# EAGLE design LCD-Backpack-PIC-HD44780-I2C-v1a (EAGLE 5.11)
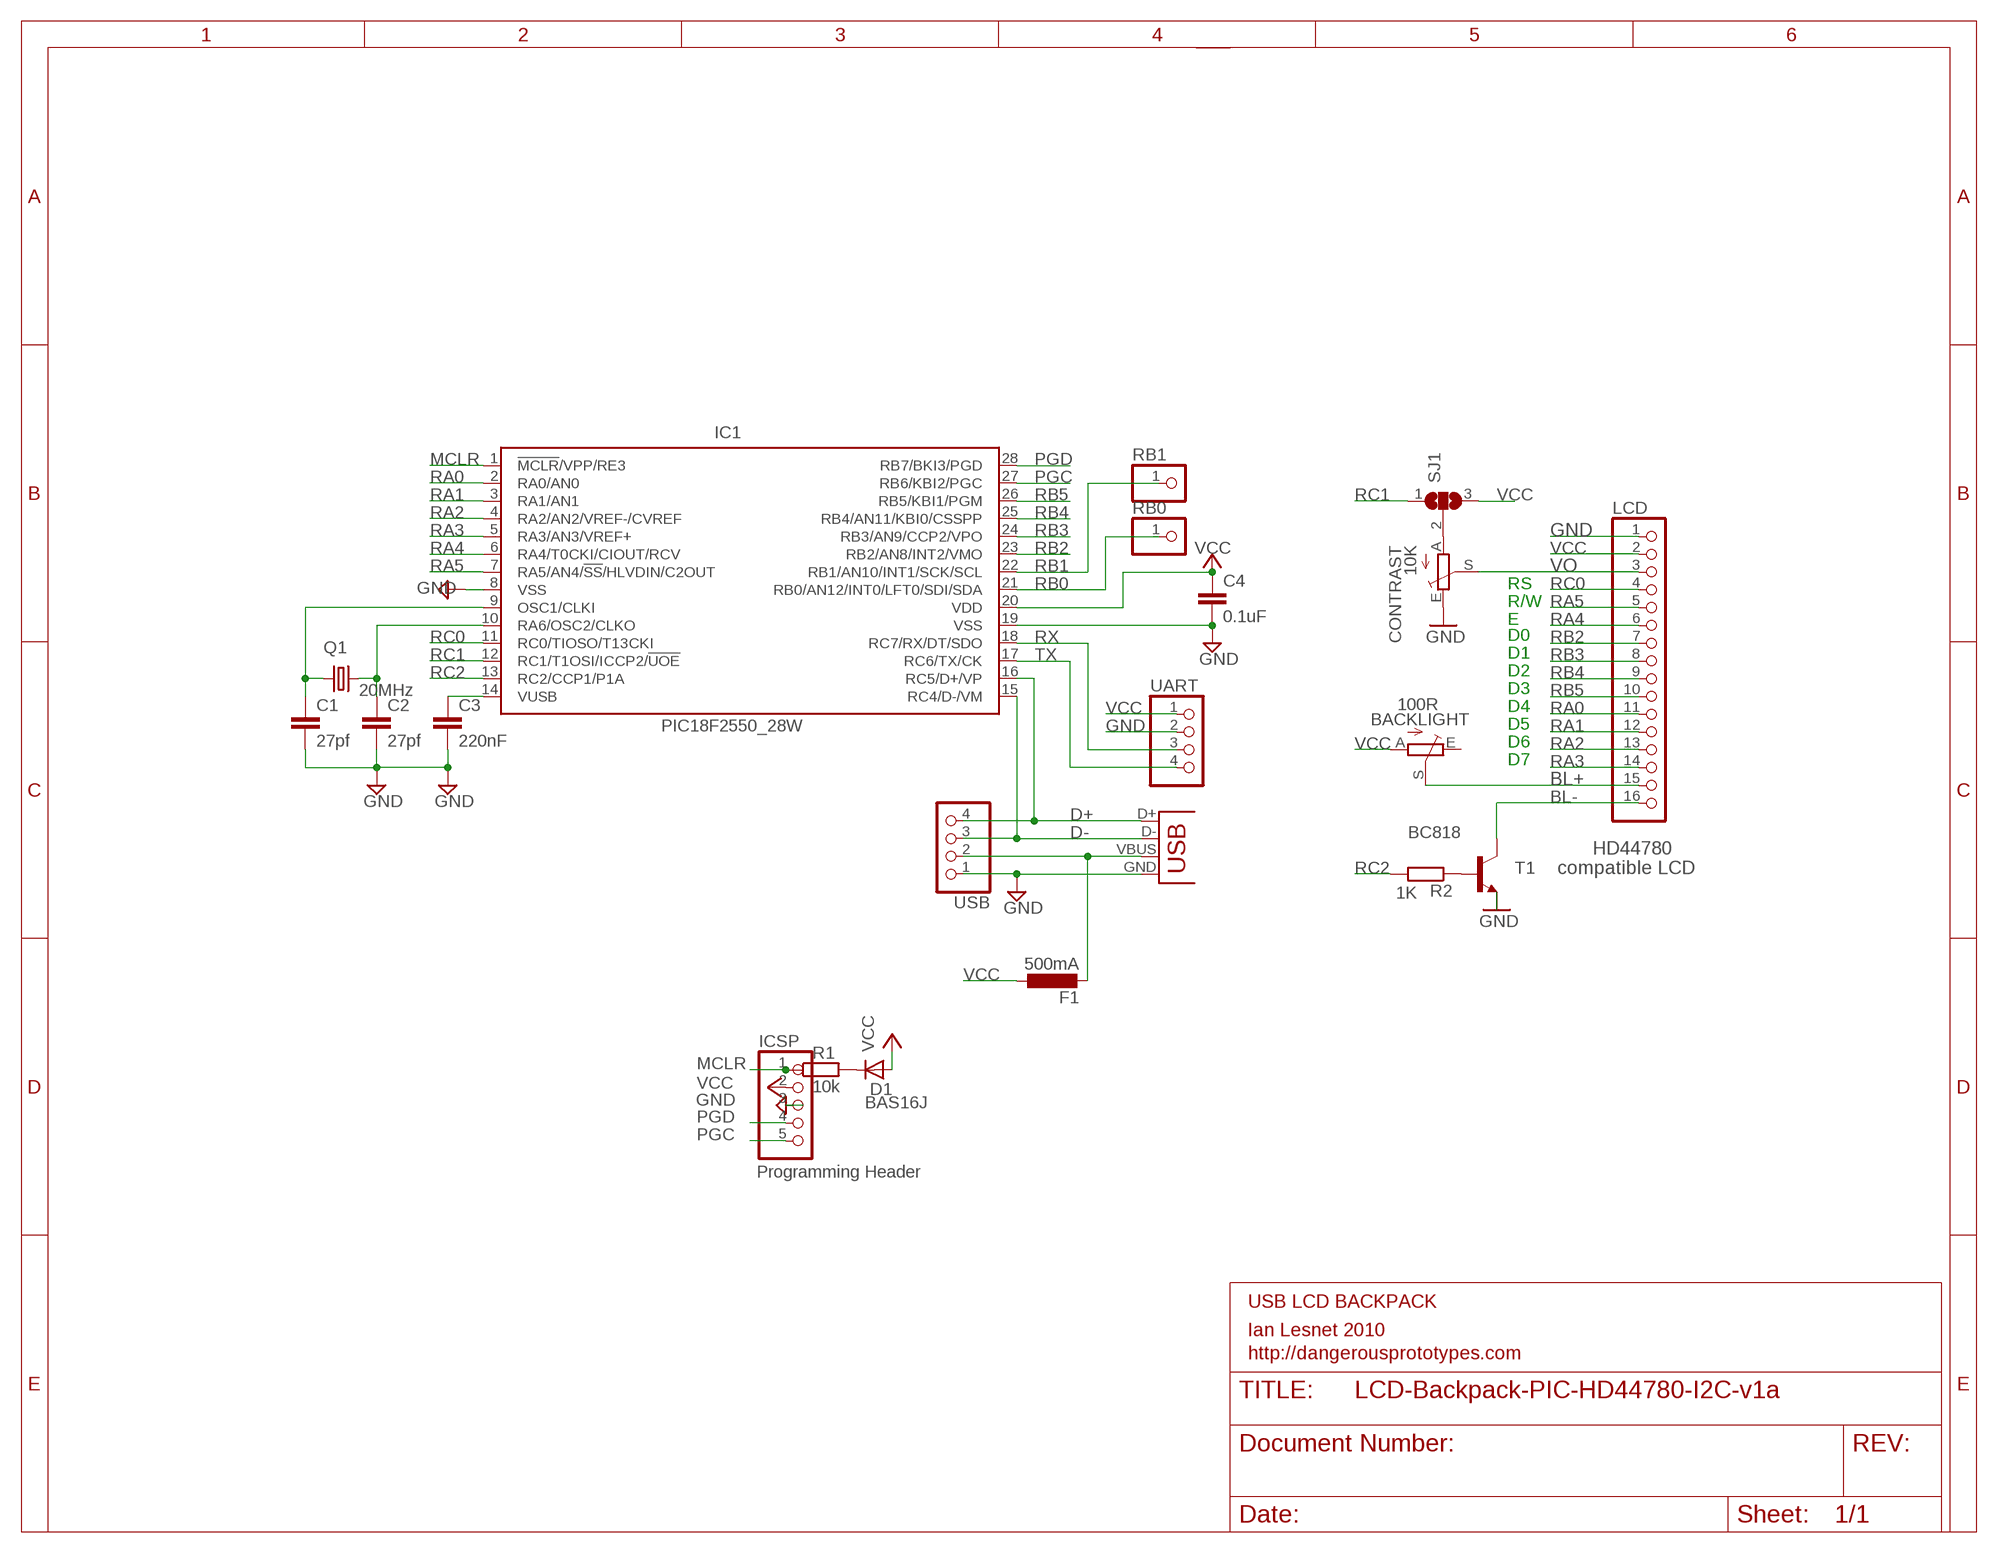
[diagram p0: schematic, sheet 1]

## Parts
BACKLIGHT  100R  TRIM_EU-B25P  [B25P]
C1  27pf  C-EUC0805  [C0805]
C2  27pf  C-EUC0805  [C0805]
C3  220nF  C-EUC0805  [C0805]
C4  0.1uF  C-EUC0805  [C0805]
CONTRAST  10K  TRIM_EU-B25P  [B25P]
D1  BAS16J  DIODE_SOD-323  [SOD2514X100N]
F1  500mA  RCL_L-EUL1812  [RCL_L1812]
IC1  PIC18F2550_28W  [SO28W]
ICSP  PINHD-1X5  [1X05]
J1  USBSMD  [USB-MINIB]
LCD  PINHD-1X16  [1X16]
Q1  20MHz  CRYSTALHC49UP  [HC49UP]
R1  10k  R-EU_R0805  [R0805]
R2  1K  R-EU_M0805  [M0805]
RB0  PINHD-1X1  [1X01]
RB1  PINHD-1X1  [1X01]
SJ1  SJ2W  [SJ_2]
T1  BC818  NPNSOT23BEC  [SOT23-BEC]
UART  PINHD-1X4  [1X04]
USB  PINHD-1X4  [1X04]

## Nets
BASE: R2.1 T1.B
BL+: BACKLIGHT.S LCD.15
BL-: LCD.16 T1.C
D+: IC1.16(RC5/D+/VP) J1.D+ USB.4
D-: IC1.15(RC4/D-/VM) J1.D- USB.3
GND: C1.2 C2.2 C3.2 C4.2 CONTRAST.E IC1.8(VSS) IC1.19(VSS) ICSP.3 J1.GND LCD.1 T1.E UART.2 USB.1
MCLR: IC1.1(!MCLR!/VPP/RE3) ICSP.1 R1.1
N$1: CONTRAST.A SJ1.2
N$4: C2.1 IC1.10(RA6/OSC2/CLKO) Q1.2
N$5: C1.1 IC1.9(OSC1/CLKI) Q1.1
N$6: C3.1 IC1.14(VUSB)
N$20: D1.K R1.2
PGC: IC1.27(RB6/KBI2/PGC) ICSP.5
PGD: IC1.28(RB7/BKI3/PGD) ICSP.4
RA0: IC1.2(RA0/AN0) LCD.11
RA1: IC1.3(RA1/AN1) LCD.12
RA2: IC1.4(RA2/AN2/VREF-/CVREF) LCD.13
RA3: IC1.5(RA3/AN3/VREF+) LCD.14
RA4: IC1.6(RA4/T0CKI/CIOUT/RCV) LCD.6
RA5: IC1.7(RA5/AN4/!SS!/HLVDIN/C2OUT) LCD.5
RB0: IC1.21(RB0/AN12/INT0/LFT0/SDI/SDA) RB0.1
RB1: IC1.22(RB1/AN10/INT1/SCK/SCL) RB1.1
RB2: IC1.23(RB2/AN8/INT2/VMO) LCD.7
RB3: IC1.24(RB3/AN9/CCP2/VPO) LCD.8
RB4: IC1.25(RB4/AN11/KBI0/CSSPP) LCD.9
RB5: IC1.26(RB5/KBI1/PGM) LCD.10
RC0: IC1.11(RC0/TIOSO/T13CKI) LCD.4
RC1: IC1.12(RC1/T1OSI/ICCP2/!UOE) SJ1.1
RC2: IC1.13(RC2/CCP1/P1A) R2.2
RX: IC1.18(RC7/RX/DT/SDO) UART.3
TX: IC1.17(RC6/TX/CK) UART.4
VCC: BACKLIGHT.A C4.1 D1.A F1.1 IC1.20(VDD) ICSP.2 LCD.2 SJ1.3 UART.1
VO: CONTRAST.S LCD.3
VUSB-UNFUSED: F1.2 J1.VBUS USB.2
Unconnected: BACKLIGHT.E

## Notes on the sheet
- RS
- R/W
- E
- D0
- D1
- D2
- D3
- D4
- D5
- D6
- D7
- HD44780
- compatible LCD
- Programming Header
- USB LCD BACKPACK
- Ian Lesnet 2010
- http://dangerousprototypes.com

## Library data of the parts
BACKLIGHT CONTRAST = pot:TRIM_EU-: POTENTIOMETER
C1-C4 = resistor:C-EU: CAPACITOR, European symbol
D1 = ipc-7351-diode:DIODE_
F1 = arduino_Uno_ref:RCL_L-EU: INDUCTOR, European symbol
IC1 = microchip:PIC18F2*_28: USB Microcontrollers with nanoWatt Technology High-Performance, Enhanced Flash, 28/40/44-Pin, Source: http://ww1.microchip.com/downloads/en/devicedoc/39632c.pdf
ICSP = pinhead-2:PINHD-1X5: PIN HEADER
J1 = SparkFun:USB: USB Connectors USB-B-PTH is fully proven SKU : PRT-00139 USB-miniB is fully proven SKU : PRT-00587 USB-A-PCB is untested. USB-A-H is throughly reviewed, but untested. Spark Fun Electronics SKU : PRT-00437 USB-B-SMT is throughly reviewed, but untested. Needs silkscreen touching up. USB-A-S has not been used/tested USB-MB-H has not been used/tested
LCD = pinhead:PINHD-1X16: PIN HEADER
Q1 = crystal:CRYSTAL: CRYSTAL
R1 R2 = rcl:R-EU_: RESISTOR, European symbol
RB0 RB1 = pinhead:PINHD-1X1: PIN HEADER
SJ1 = jumper:SJ2W: SMD solder JUMPER
T1 = dp_devices:NPN: Most commonly used is SOT23-BEC
UART USB = pinhead - Copy:PINHD-1X4: PIN HEADER

## Board
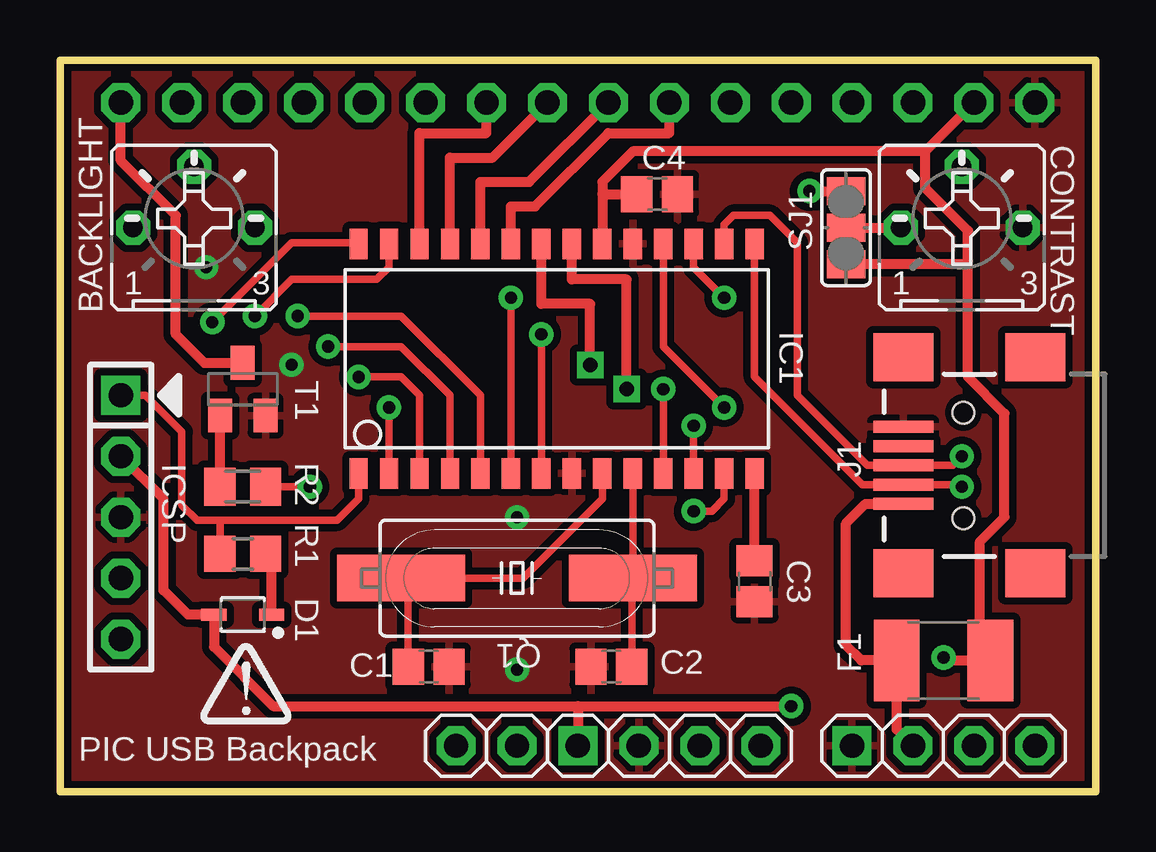
[diagram p1: board, top side]
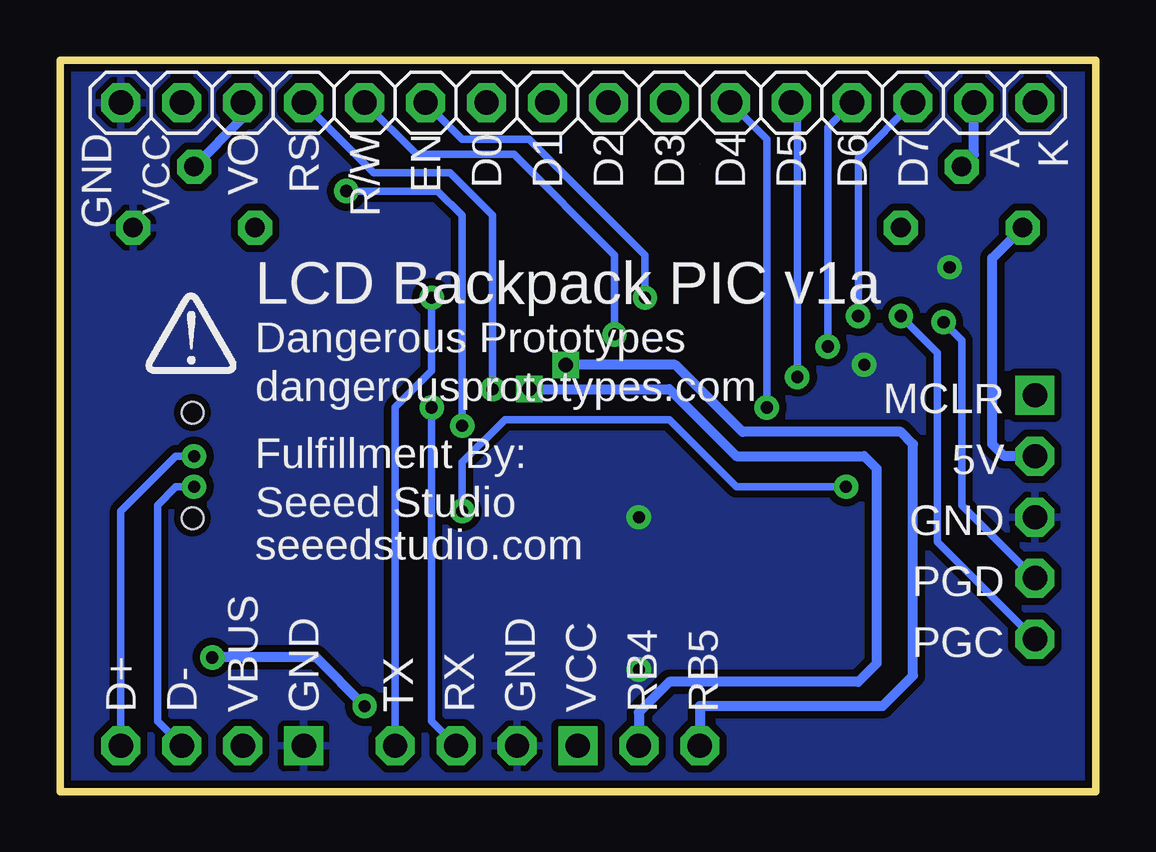
[diagram p2: board, bottom side, seen from below]

Size 43.18 x 30.48 mm. Coordinates in mm from the lower left corner, seen from the top.
Outline: 43.18,30.48 0,30.48 0,0 43.18,0 43.18,30.48
Copper layers (1*16): Top 0.035mm / dielectric 1.5mm / Bottom 0.035mm
Design rules "SparkFun": minimum track width 8mil, minimum drill 20mil, track to track 8mil, track to pad 8mil, pad to pad 8mil, via to via 8mil, smd to smd 8mil, copper to edge 10mil, drill to drill 8mil, minimum pad ring 12mil, minimum via ring 10mil, stop-mask expansion 4mil, vias tented up to drill 25mil, thermal gap 10mil

### Footprints (pad centres in the part's own frame; a part is rotated, then mirrored left to right if it is on the bottom)
B25P = drill 0.813 octagon: A -2.54,0; E 2.54,0; S 0,2.54
C0805 = smd 1.3 x 1.5: 1 -0.85,0; 2 0.85,0
SOD2514X100N = smd 1.05 x 0.5: A 1.2,0; K -1.2,0
RCL_L1812 = smd 1.9 x 3.4: 1 -1.95,0; 2 1.95,0
SO28W = smd 0.762 x 1.27: 1 -7.62,-4.78; 2 -6.35,-4.78; 3 -5.08,-4.78; 4 -3.81,-4.78; 5 -2.54,-4.78; 6 -1.27,-4.78; 7 0,-4.78; 8 1.27,-4.78; 9 2.54,-4.78; 10 3.81,-4.78; 11 5.08,-4.78; 12 6.35,-4.78; 13 7.62,-4.78; 14 8.89,-4.78; 15 8.89,4.78; 16 7.62,4.78; 17 6.35,4.78; 18 5.08,4.78; 19 3.81,4.78; 20 2.54,4.78; 21 1.27,4.78; 22 0,4.78; 23 -1.27,4.78; 24 -2.54,4.78; 25 -3.81,4.78; 26 -5.08,4.78; 27 -6.35,4.78; 28 -7.62,4.78
1X05 = drill 1.016 square: 1 -5.08,0 | drill 1.016 octagon: 2 -2.54,0; 3 0,0; 4 2.54,0; 5 5.08,0
USB-MINIB = smd 2.5 x 0.5: D+ 2.5,0; D- 2.5,0.8; GND 2.5,-1.6; ID 2.5,-0.8; VBUS 2.5,1.6 | smd 2.5 x 2: GND@1 -3,-4.5; GND@2 -3,4.5; GND@3 2.5,4.5; GND@4 2.5,-4.5 | hole 0.9: 0,2.2; 0,-2.2
1X16 = drill 1.016 octagon: 1 -19.05,0; 2 -16.51,0; 3 -13.97,0; 4 -11.43,0; 5 -8.89,0; 6 -6.35,0; 7 -3.81,0; 8 -1.27,0; 9 1.27,0; 10 3.81,0; 11 6.35,0; 12 8.89,0; 13 11.43,0; 14 13.97,0; 15 16.51,0; 16 19.05,0
HC49UP = smd 5.334 x 1.93: 1 -4.826,0; 2 4.826,0
R0805 = smd 1.3 x 1.5: 1 -0.95,0; 2 0.95,0
M0805 = smd 1.3 x 1.6: 1 -0.95,0; 2 0.95,0
1X01 = drill 1.016 octagon: 1 0,0
SJ_2 = smd 1.168 x 1.6: 1 -1.524,0; 2 0,0; 3 1.524,0
SOT23-BEC = smd 1 x 1.4: B -0.95,-1.1; C 0,1.1; E 0.95,-1.1
1X04 = drill 1.016 square: 1 -3.81,0 | drill 1.016 octagon: 2 -1.27,0; 3 1.27,0; 4 3.81,0

### Placement (x,y rotation side)
BACKLIGHT  5.59,23.5 0 top
C1  15.37,5.21 0 top
C2  22.99,5.21 180 top
C3  28.96,8.76 270 top
C4  24.89,24.89 0 top
CONTRAST  37.59,23.5 0 top
D1  7.62,7.37 180 top
F1  36.83,5.46 180 top
IC1  20.07,18.03 0 top
ICSP  2.54,11.43 270 top
J1  37.66,13.59 180 top
LCD  21.59,28.7 0 bottom
Q1  19.05,8.89 0 top
R1  7.62,9.91 0 top
R2  7.62,12.7 0 top
RB0  19.05,1.91 90 top
RB1  16.51,1.91 270 top
SJ1  32.77,23.5 270 top
T1  7.62,16.76 0 top
U$1  [DP_LOGO]  7.75,3.43 0 top
U$2  [DP_LOGO]  37.72,18.03 0 bottom
UART  25.4,1.91 0 top
USB  36.83,1.91 0 top

### Tracks (layer width: path | path; a pad name or v marks a point on that pad's centre or on a via)
BASE
  Top 0.406: R2.1 T1.B
BL+
  Bottom 0.406: LCD.15 5.08,26.54 BACKLIGHT.S
BL-
  Top 0.406: LCD.16 2.54,26.29 4.83,24 4.83,19.05 6.01,17.86 T1.C
D+  (via drill 0.51)
  Top 0.305: IC1.16 27.69,23.62 28.07,24 29.59,24 30.73,22.86 30.73,16.51 33.66,13.59 J1.D+ 37.21,13.59 v37.59,13.97
  Bottom 0.305: v37.59,13.97 38.35,13.97 40.64,11.68 USB.4
D-  (via drill 0.51)
  Top 0.305: IC1.15 28.96,17.27 33.44,12.79 J1.D- 37.5,12.79 v37.59,12.7
  Bottom 0.305: USB.3 39.12,2.92 39.12,11.94 38.35,12.7 v37.59,12.7
GND  (via drill 0.51)  (1 unrouted)
  other vias: 19.05,11.43 19.05,5.08 9.65,17.78 6.1,21.84
  pour Bottom (isolate 0.305): 43.18,0 43.18,30.48 0,30.48 0,0
  pour Top (isolate 0.305): 43.18,0 43.18,30.48 0,30.48 0,0
MCLR
  Top 0.305: IC1.1 12.45,12.19 11.56,11.3 6.6,11.3 | ICSP.1 3.56,16.51 5.08,14.99 5.08,11.94 5.71,11.3 6.6,11.3 | R1.1 6.67,11.24 6.6,11.3
N$1
  Top 0.406: SJ1.2 CONTRAST.A
N$2
  Top 0.254: 32.77,21.84 32.77,23.37
N$4
  Top 0.305: IC1.10 Q1.2 23.84,8.85 C2.1
N$5
  Top 0.305: C1.1 14.52,8.6 Q1.1 19.3,8.89 22.61,12.19 IC1.9
N$6
  Top 0.406: C3.1 IC1.14
N$20
  Top 0.406: D1.K 8.82,9.91 R1.2
PGC  (via drill 0.51)
  Top 0.305: IC1.27 13.72,21.84 13.21,21.34 9.65,21.34 v8.13,19.81
  Bottom 0.305: ICSP.5 6.6,10.41 6.6,18.29 v8.13,19.81
PGD  (via drill 0.51)
  Top 0.305: IC1.28 12.45,22.86 9.65,22.86 v6.35,19.56
  Bottom 0.305: ICSP.4 5.59,11.94 5.59,18.8 v6.35,19.56
RA0  (via drill 0.51)
  Top 0.305: IC1.2 v13.72,16
  Bottom 0.305: v13.72,16 13.72,27.18 LCD.11
RA1  (via drill 0.51)
  Top 0.305: v12.45,17.27 14.22,17.27 14.99,16.51 IC1.3
  Bottom 0.305: v12.45,17.27 12.45,28.45 LCD.12
RA2  (via drill 0.51)
  Top 0.305: v11.18,18.54 14.22,18.54 16.26,16.51 IC1.4
  Bottom 0.305: LCD.13 11.18,27.69 v11.18,18.54
RA3  (via drill 0.51)
  Top 0.305: v9.91,19.81 14.22,19.81 17.53,16.51 IC1.5
  Bottom 0.305: LCD.14 9.91,26.42 v9.91,19.81
RA4  (via drill 0.51)
  Top 0.305: IC1.6 v18.8,20.57
  Bottom 0.305: LCD.6 26.42,27.18 23.62,27.18 18.8,22.35 v18.8,20.57
RA5  (via drill 0.51)
  Top 0.305: IC1.7 v20.07,19.05
  Bottom 0.305: LCD.5 28.32,26.54 24.26,26.54 20.07,22.35 v20.07,19.05
RB0  (via drill 0.6)
  Top 0.406: IC1.21 21.34,21.34 23.62,21.34 v23.62,16.76
  Bottom 0.406: v23.62,16.76 17.78,16.76 14.99,13.97 9.65,13.97 9.14,13.46 9.14,5.33 9.91,4.57 17.78,4.57 19.05,3.3 RB0.1
RB1  (via drill 0.6)
  Top 0.406: v22.1,17.78 22.1,20.32 20.07,20.32 IC1.22
  Bottom 0.406: RB1.1 16.51,3.56 8.89,3.56 7.62,4.83 7.62,14.48 8.13,14.99 14.73,14.99 17.53,17.78 v22.1,17.78
RB2
  Top 0.406: IC1.23 18.8,24.38 19.81,24.38 22.86,27.43 25.4,27.43 LCD.7
RB3
  Top 0.406: IC1.24 17.53,25.4 19.56,25.4 LCD.8
RB4
  Top 0.406: IC1.25 16.26,26.42 18.03,26.42 LCD.9
RB5
  Top 0.406: IC1.26 14.99,27.43 17.78,27.43 LCD.10
RC0  (via drill 0.51)
  Top 0.305: IC1.11 v25.15,16.76
  Bottom 0.305: v25.15,16.76 25.15,24 26.92,25.78 30.1,25.78 LCD.4
RC1  (via drill 0.51)
  Top 0.305: IC1.12 v26.42,15.24
  Top 0.406: v31.24,25.02 SJ1.1
  Bottom 0.305: v31.24,25.02 27.43,25.02 26.42,24 v26.42,15.24
RC2  (via drill 0.51)
  Top 0.305: IC1.13 27.69,12.19 27.18,11.68 v26.42,11.68 | R2.2 v10.41,12.7
  Bottom 0.305: v26.42,11.68 26.42,13.72 24.64,15.49 17.78,15.49 14.99,12.7 v10.41,12.7
RX  (via drill 0.51)
  Top 0.305: v27.69,16 25.15,18.54 IC1.18
  Bottom 0.305: v27.69,16 27.69,2.92 UART.3
TX  (via drill 0.51)
  Top 0.305: v27.69,20.57 26.42,21.84 IC1.17
  Bottom 0.305: v27.69,20.57 27.69,17.53 29.21,16 UART.4
VCC  (via drill 0.51)
  Top 0.406: ICSP.2 4.32,12.19 4.32,8.38 5.33,7.37 D1.A 6.42,6.03 8.89,3.56 21.59,3.56 | v36.83,5.59 36.96,5.46 F1.1 38.35,6.14 38.35,10.41 39.37,11.43 39.37,15.75 37.85,17.27 37.85,22.1 | 37.85,22.1 37.85,23.37 36.07,25.15 36.07,26.67 | SJ1.3 37.72,21.97 37.85,22.1 | 21.59,3.56 v30.48,3.56 | 21.59,3.56 UART.1 | 36.07,26.67 LCD.2 | 36.07,26.67 23.88,26.67 22.61,25.4 22.61,24.89 | 22.61,24.89 IC1.20 | 22.61,24.89 C4.1
  Bottom 0.406: v36.83,5.59 32.51,5.59 v30.48,3.56 | ICSP.2 3.81,13.97 4.32,14.48 4.32,22.23 BACKLIGHT.A
VO
  Bottom 0.406: LCD.3 35.56,28.07 CONTRAST.S
VUSB-UNFUSED
  Top 0.406: J1.VBUS 33.58,11.99 32.77,11.18 32.77,6.1 33.4,5.46 F1.2 34.88,2.58 USB.2

### Text on the board
tNames: PIC USB Backpack
bNames: K | A | D7 | D6 | D5 | D4 | D3 | D2 | D1 | D0 | EN | R/W | RS | VO | VCC | GND | LCD Backpack PIC v1a | Dangerous Prototypes | MCLR | dangerousprototypes.com | 5V | Fulfillment By: | GND | Seeed Studio | seeedstudio.com | PGD | PGC | RB5 | RB4 | VCC | GND | RX | TX | GND | VBUS | D- | D+
Document: 2011 DangerousPrototypes.com | CC-BY-SA